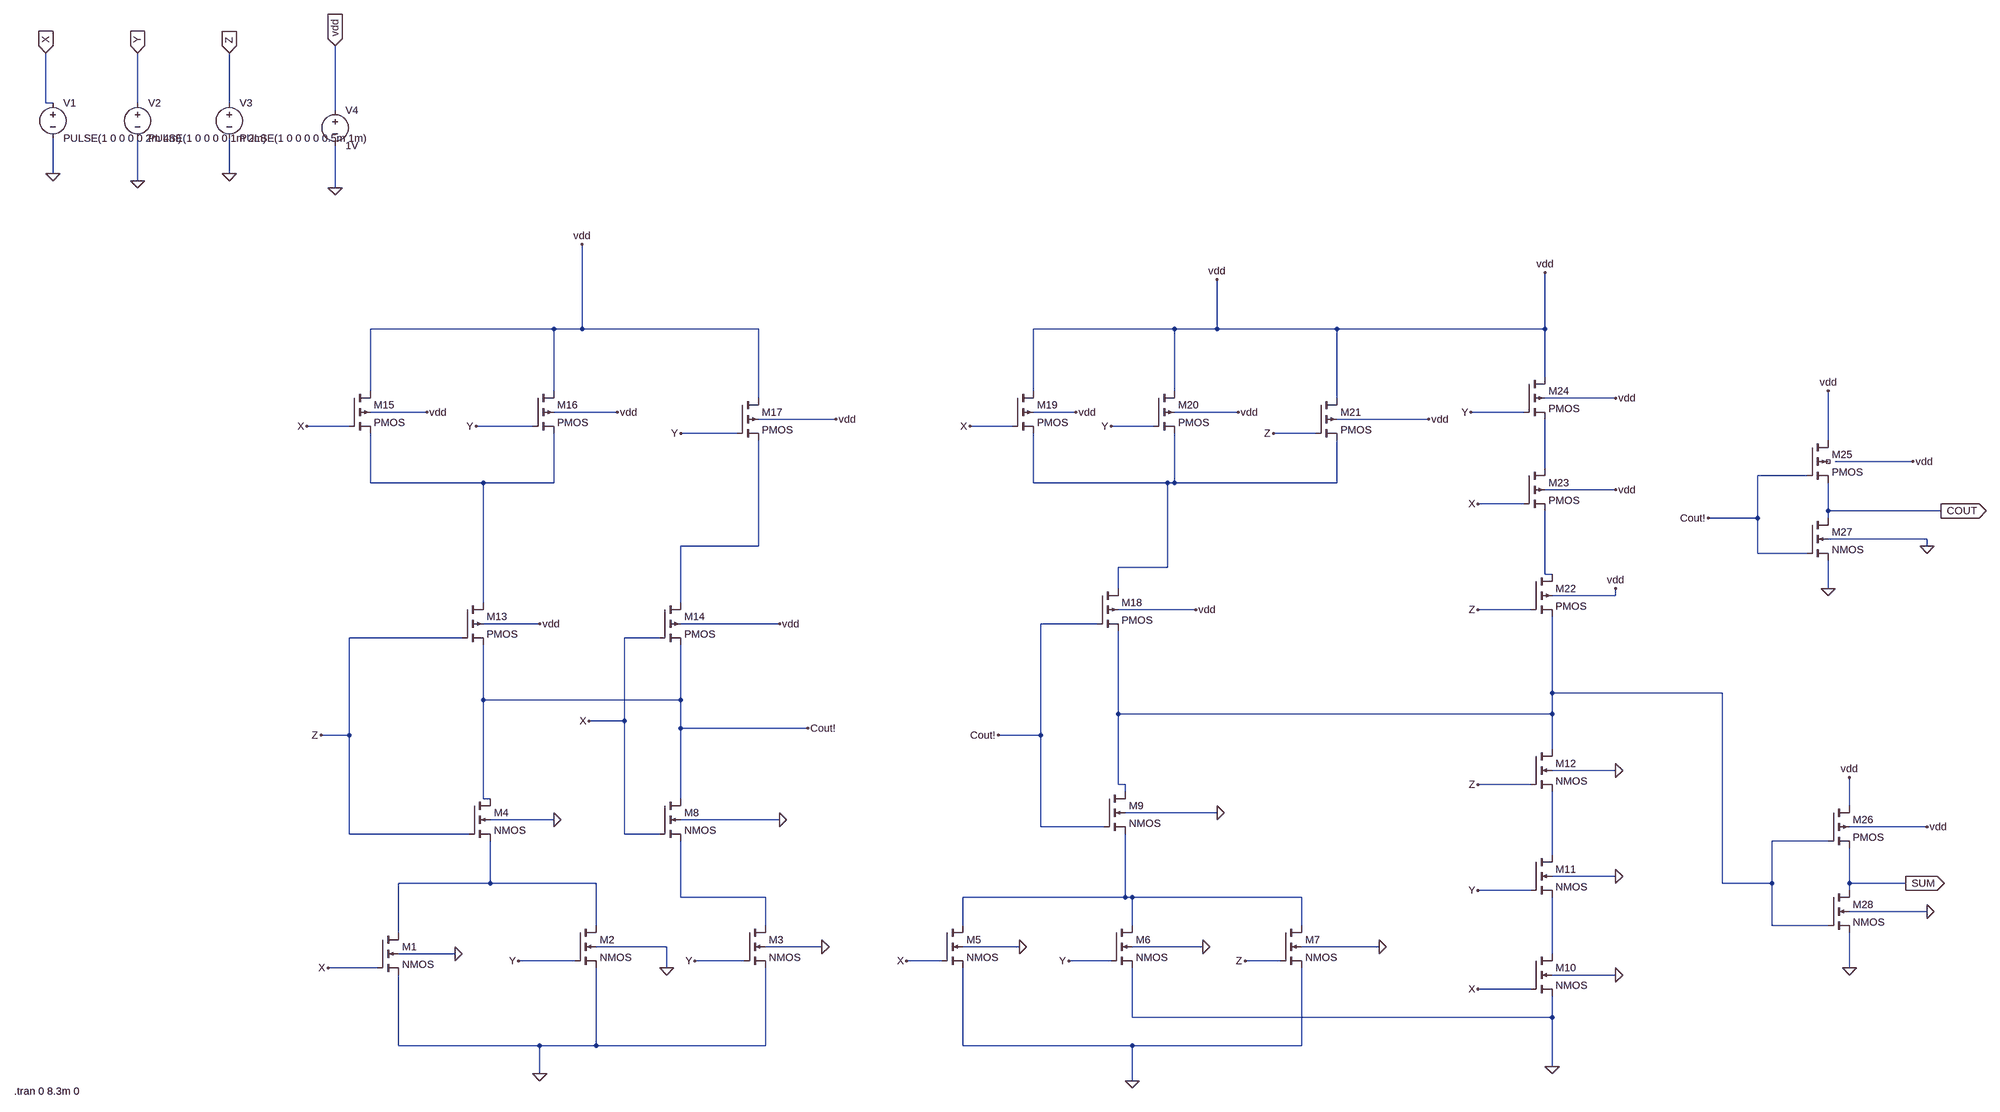
[diagram p0: schematic QUESTION1_28transistor.asc]
QUESTION1_28transistor.asc, the LTspice schematic file:
Version 4
SHEET 1 3292 1160
WIRE -1312 -1632 -1312 -1776
WIRE -1296 -1632 -1312 -1632
WIRE -1104 -1632 -1104 -1776
WIRE -896 -1632 -896 -1776
WIRE -656 -1616 -656 -1792
WIRE -1296 -1472 -1296 -1552
WIRE -896 -1472 -896 -1552
WIRE -1104 -1456 -1104 -1552
WIRE -656 -1440 -656 -1536
WIRE -160 -1120 -576 -1120
WIRE -96 -1120 -96 -1312
WIRE -96 -1120 -160 -1120
WIRE 304 -1120 -96 -1120
WIRE 1248 -1120 928 -1120
WIRE 1344 -1120 1344 -1232
WIRE 1344 -1120 1248 -1120
WIRE 1616 -1120 1344 -1120
WIRE 2128 -1120 2128 -1248
WIRE 2128 -1120 1616 -1120
WIRE 2128 -896 2128 -1120
WIRE -576 -864 -576 -1120
WIRE -160 -864 -160 -1120
WIRE 928 -864 928 -1120
WIRE 1248 -864 1248 -1120
WIRE 304 -848 304 -1120
WIRE 1616 -848 1616 -1120
WIRE 2288 -848 2128 -848
WIRE -448 -816 -576 -816
WIRE -16 -816 -160 -816
WIRE 1024 -816 928 -816
WIRE 1392 -816 1248 -816
WIRE 2080 -816 1920 -816
WIRE 480 -800 304 -800
WIRE 1824 -800 1616 -800
WIRE -624 -784 -720 -784
WIRE -208 -784 -336 -784
WIRE 880 -784 784 -784
WIRE 1200 -784 1104 -784
WIRE 256 -768 128 -768
WIRE 1568 -768 1472 -768
WIRE 2912 -752 2912 -864
WIRE 3104 -704 2928 -704
WIRE 2128 -688 2128 -800
WIRE 2864 -672 2752 -672
WIRE -576 -656 -576 -768
WIRE -320 -656 -576 -656
WIRE -160 -656 -160 -768
WIRE -160 -656 -320 -656
WIRE 928 -656 928 -768
WIRE 1232 -656 928 -656
WIRE 1248 -656 1248 -768
WIRE 1248 -656 1232 -656
WIRE 1616 -656 1616 -752
WIRE 1616 -656 1248 -656
WIRE 2288 -640 2128 -640
WIRE 2080 -608 1936 -608
WIRE 2912 -592 2912 -656
WIRE 3168 -592 2912 -592
WIRE 2752 -576 2752 -672
WIRE 2752 -576 2640 -576
WIRE 2912 -576 2912 -592
WIRE 3136 -528 2912 -528
WIRE 304 -512 304 -752
WIRE 304 -512 128 -512
WIRE 3136 -512 3136 -528
WIRE 2752 -496 2752 -576
WIRE 2864 -496 2752 -496
WIRE 1232 -464 1232 -656
WIRE 1232 -464 1120 -464
WIRE 2128 -448 2128 -592
WIRE 2144 -448 2128 -448
WIRE 1120 -416 1120 -464
WIRE 2912 -416 2912 -480
WIRE 2288 -400 2288 -416
WIRE 2288 -400 2144 -400
WIRE -320 -384 -320 -656
WIRE 128 -384 128 -512
WIRE 1296 -368 1120 -368
WIRE 2096 -368 1936 -368
WIRE -192 -336 -320 -336
WIRE 352 -336 128 -336
WIRE 1072 -336 944 -336
WIRE -368 -304 -624 -304
WIRE 80 -304 0 -304
WIRE 2144 -176 2144 -352
WIRE 2672 -176 2144 -176
WIRE -320 -160 -320 -288
WIRE 128 -160 128 -288
WIRE 128 -160 -320 -160
WIRE 1120 -128 1120 -320
WIRE 2144 -128 2144 -176
WIRE 2144 -128 1120 -128
WIRE 0 -112 0 -304
WIRE 0 -112 -80 -112
WIRE 128 -96 128 -160
WIRE 416 -96 128 -96
WIRE -624 -80 -624 -304
WIRE -624 -80 -688 -80
WIRE 944 -80 944 -336
WIRE 944 -80 848 -80
WIRE 2144 -48 2144 -128
WIRE 2288 0 2144 0
WIRE 1120 32 1120 -128
WIRE 1136 32 1120 32
WIRE 2096 32 1936 32
WIRE 1136 48 1136 32
WIRE -320 64 -320 -160
WIRE -304 64 -320 64
WIRE 128 64 128 -96
WIRE 2960 80 2960 16
WIRE 1344 96 1136 96
WIRE -160 112 -304 112
WIRE 352 112 128 112
WIRE 944 128 944 -80
WIRE 1088 128 944 128
WIRE 3136 128 2960 128
WIRE -624 144 -624 -80
WIRE -352 144 -624 144
WIRE 0 144 0 -112
WIRE 80 144 0 144
WIRE 2912 160 2784 160
WIRE 2144 192 2144 48
WIRE 2288 240 2144 240
WIRE -304 256 -304 160
WIRE -304 256 -512 256
WIRE -64 256 -304 256
WIRE 2672 256 2672 -176
WIRE 2784 256 2784 160
WIRE 2784 256 2672 256
WIRE 2960 256 2960 176
WIRE 3088 256 2960 256
WIRE 2096 272 1936 272
WIRE 2960 272 2960 256
WIRE 128 288 128 160
WIRE 320 288 128 288
WIRE 1136 288 1136 144
WIRE 1136 288 768 288
WIRE 1152 288 1136 288
WIRE 1536 288 1152 288
WIRE 3136 320 2960 320
WIRE -64 352 -64 256
WIRE 320 352 320 288
WIRE 768 352 768 288
WIRE 1152 352 1152 288
WIRE 1536 352 1536 288
WIRE 2784 352 2784 256
WIRE 2912 352 2784 352
WIRE -512 368 -512 256
WIRE 96 400 -64 400
WIRE 448 400 320 400
WIRE 896 400 768 400
WIRE 1312 400 1152 400
WIRE 1712 400 1536 400
WIRE -384 416 -512 416
WIRE 2144 416 2144 288
WIRE -112 432 -240 432
WIRE 272 432 160 432
WIRE 720 432 640 432
WIRE 1104 432 1008 432
WIRE 1488 432 1408 432
WIRE -560 448 -672 448
WIRE 96 448 96 400
WIRE 2960 448 2960 368
WIRE 2288 464 2144 464
WIRE 2096 496 1936 496
WIRE 1152 560 1152 448
WIRE 2144 560 2144 512
WIRE 2144 560 1152 560
WIRE -512 624 -512 464
WIRE -192 624 -512 624
WIRE -64 624 -64 448
WIRE -64 624 -192 624
WIRE 320 624 320 448
WIRE 320 624 -64 624
WIRE 768 624 768 448
WIRE 1152 624 768 624
WIRE 1536 624 1536 448
WIRE 1536 624 1152 624
WIRE 2144 672 2144 560
WIRE -192 688 -192 624
WIRE 1152 704 1152 624
FLAG -720 -784 X
FLAG -672 448 X
FLAG -80 -112 X
FLAG 784 -784 X
FLAG 1936 -608 X
FLAG 1936 496 X
FLAG 640 432 X
FLAG -336 -784 Y
FLAG 128 -768 Y
FLAG -240 432 Y
FLAG 160 432 Y
FLAG 1008 432 Y
FLAG 1104 -784 Y
FLAG 1920 -816 Y
FLAG 1936 272 Y
FLAG -688 -80 Z
FLAG 1472 -768 Z
FLAG 1408 432 Z
FLAG 1936 32 Z
FLAG 1936 -368 Z
FLAG 416 -96 Cout!
FLAG 848 -80 Cout!
FLAG 2640 -576 Cout!
FLAG 3168 -592 COUT
IOPIN 3168 -592 Out
FLAG 3088 256 SUM
IOPIN 3088 256 Out
FLAG -448 -816 vdd
FLAG -16 -816 vdd
FLAG -96 -1312 vdd
FLAG 480 -800 vdd
FLAG 1024 -816 vdd
FLAG 1392 -816 vdd
FLAG 1344 -1232 vdd
FLAG 1824 -800 vdd
FLAG 2128 -1248 vdd
FLAG 2288 -848 vdd
FLAG 2288 -640 vdd
FLAG 2288 -416 vdd
FLAG 2912 -864 vdd
FLAG 3104 -704 vdd
FLAG 3136 128 vdd
FLAG 2960 16 vdd
FLAG 1296 -368 vdd
FLAG 352 -336 vdd
FLAG -192 -336 vdd
FLAG -192 688 0
FLAG 96 448 0
FLAG -384 416 0
FLAG 448 400 0
FLAG 896 400 0
FLAG 1312 400 0
FLAG 1712 400 0
FLAG 2144 672 0
FLAG 2960 448 0
FLAG 2912 -416 0
FLAG 2288 0 0
FLAG 2288 240 0
FLAG 2288 464 0
FLAG 3136 320 0
FLAG 3136 -512 0
FLAG 1152 704 0
FLAG -656 -1792 vdd
IOPIN -656 -1792 In
FLAG -1312 -1776 X
IOPIN -1312 -1776 In
FLAG -1104 -1776 Y
IOPIN -1104 -1776 In
FLAG -896 -1776 Z
IOPIN -896 -1776 In
FLAG -656 -1440 0
FLAG -896 -1472 0
FLAG -1104 -1456 0
FLAG -1296 -1472 0
FLAG -160 112 0
FLAG 352 112 0
FLAG 1344 96 0
SYMBOL nmos4 -560 368 R0
SYMATTR InstName M1
SYMATTR Value2 l=50n w=400n
SYMBOL nmos4 -112 352 R0
SYMATTR InstName M2
SYMATTR Value2 l=50n w=400n
SYMBOL nmos4 272 352 R0
SYMATTR InstName M3
SYMATTR Value2 l=50n w=400n
SYMBOL nmos4 -352 64 R0
SYMATTR InstName M4
SYMATTR Value2 l=50n w=400n
SYMBOL nmos4 720 352 R0
SYMATTR InstName M5
SYMATTR Value2 l=50n w=200n
SYMBOL nmos4 1104 352 R0
SYMATTR InstName M6
SYMATTR Value2 l=50n w=200n
SYMBOL nmos4 1488 352 R0
SYMATTR InstName M7
SYMATTR Value2 l=50n w=200n
SYMBOL nmos4 80 64 R0
SYMATTR InstName M8
SYMATTR Value2 l=50n w=400n
SYMBOL nmos4 1088 48 R0
SYMATTR InstName M9
SYMATTR Value2 l=50n w=200n
SYMBOL nmos4 2096 416 R0
SYMATTR InstName M10
SYMATTR Value2 l=50n w=300n
SYMBOL nmos4 2096 192 R0
SYMATTR InstName M11
SYMATTR Value2 l=50n w=300n
SYMBOL nmos4 2096 -48 R0
SYMATTR InstName M12
SYMATTR Value2 l=50n w=300n
SYMBOL pmos4 -368 -384 R0
SYMATTR InstName M13
SYMATTR Value2 l=50n w=800n
SYMBOL pmos4 80 -384 R0
SYMATTR InstName M14
SYMATTR Value2 l=50n w=800n
SYMBOL pmos4 -624 -864 R0
SYMATTR InstName M15
SYMATTR Value2 l=50n w=800n
SYMBOL pmos4 -208 -864 R0
SYMATTR InstName M16
SYMATTR Value2 l=50n w=800n
SYMBOL pmos4 256 -848 R0
SYMATTR InstName M17
SYMATTR Value2 l=50n w=800n
SYMBOL pmos4 1072 -416 R0
SYMATTR InstName M18
SYMATTR Value2 l=50n w=400n
SYMBOL pmos4 880 -864 R0
SYMATTR InstName M19
SYMATTR Value2 l=50n w=400n
SYMBOL pmos4 1200 -864 R0
SYMATTR InstName M20
SYMATTR Value2 l=50n w=400n
SYMBOL pmos4 1568 -848 R0
SYMATTR InstName M21
SYMATTR Value2 l=50n w=400n
SYMBOL pmos4 2096 -448 R0
SYMATTR InstName M22
SYMATTR Value2 l=50n w=600n
SYMBOL pmos4 2080 -688 R0
SYMATTR InstName M23
SYMATTR Value2 l=50n w=600n
SYMBOL pmos4 2080 -896 R0
SYMATTR InstName M24
SYMATTR Value2 l=50n w=600n
SYMBOL pmos4 2864 -752 R0
SYMATTR InstName M25
SYMATTR Value2 l=50n w=200n
SYMBOL pmos4 2912 80 R0
SYMATTR InstName M26
SYMATTR Value2 l=50n w=200n
SYMBOL nmos4 2864 -576 R0
SYMATTR InstName M27
SYMATTR Value2 l=50n w=100n
SYMBOL nmos4 2912 272 R0
SYMATTR InstName M28
SYMATTR Value2 l=50n w=100n
SYMBOL voltage -1296 -1648 R0
WINDOW 123 0 0 Left 0
WINDOW 39 0 0 Left 0
SYMATTR InstName V1
SYMATTR Value PULSE(1 0 0 0 0 2m 4m)
SYMBOL voltage -1104 -1648 R0
WINDOW 123 0 0 Left 0
WINDOW 39 0 0 Left 0
SYMATTR InstName V2
SYMATTR Value PULSE(1 0 0 0 0 1m 2m)
SYMBOL voltage -896 -1648 R0
WINDOW 123 0 0 Left 0
WINDOW 39 0 0 Left 0
SYMATTR InstName V3
SYMATTR Value PULSE(1 0 0 0 0 0.5m 1m)
SYMBOL voltage -656 -1632 R0
WINDOW 123 0 0 Left 0
WINDOW 39 0 0 Left 0
SYMATTR InstName V4
SYMATTR Value 1V
TEXT -1384 728 Left 2 !.tran 0 8.3m 0

The netlist it stands for:
* QUESTION1_28transistor.asc
M1 N008 X 0 0 NMOS l=50n w=400n
M2 N008 Y 0 0 NMOS l=50n w=400n
M3 N009 Y 0 0 NMOS l=50n w=400n
M4 Cout! Z N008 0 NMOS l=50n w=400n
M5 N010 X 0 0 NMOS l=50n w=200n
M6 N010 Y 0 0 NMOS l=50n w=200n
M7 N010 Z 0 0 NMOS l=50n w=200n
M8 Cout! X N009 0 NMOS l=50n w=400n
M9 N006 Cout! N010 0 NMOS l=50n w=200n
M10 N011 X 0 0 NMOS l=50n w=300n
M11 N007 Y N011 0 NMOS l=50n w=300n
M12 N006 Z N007 0 NMOS l=50n w=300n
M13 N002 Z Cout! vdd PMOS l=50n w=800n
M14 N004 X Cout! vdd PMOS l=50n w=800n
M15 vdd X N002 vdd PMOS l=50n w=800n
M16 vdd Y N002 vdd PMOS l=50n w=800n
M17 vdd Y N004 vdd PMOS l=50n w=800n
M18 N003 Cout! N006 vdd PMOS l=50n w=400n
M19 vdd X N003 vdd PMOS l=50n w=400n
M20 vdd Y N003 vdd PMOS l=50n w=400n
M21 vdd Z N003 vdd PMOS l=50n w=400n
M22 N005 Z N006 vdd PMOS l=50n w=600n
M23 N001 X N005 vdd PMOS l=50n w=600n
M24 vdd Y N001 vdd PMOS l=50n w=600n
M25 vdd Cout! COUT NC_01 PMOS l=50n w=200n
M26 vdd N006 SUM vdd PMOS l=50n w=200n
M27 COUT Cout! 0 0 NMOS l=50n w=100n
M28 SUM N006 0 0 NMOS l=50n w=100n
V1 X 0 PULSE(1 0 0 0 0 2m 4m)
V2 Y 0 PULSE(1 0 0 0 0 1m 2m)
V3 Z 0 PULSE(1 0 0 0 0 0.5m 1m)
V4 vdd 0 1V
.model NMOS NMOS
.model PMOS PMOS
.lib standard.mos
.tran 0 8.3m 0
.backanno
.end